# Altium schematic sheet NBT_PS2_INT.SCHDOC
size A4; Organization: Altium Limited; Address1: L3, 12a Rodborough Rd; Address2: Frenchs Forest; Address3: NSW; Address4: Australia 2086; DocumentNumber: 10; SheetNumber: 10; SheetTotal: 12
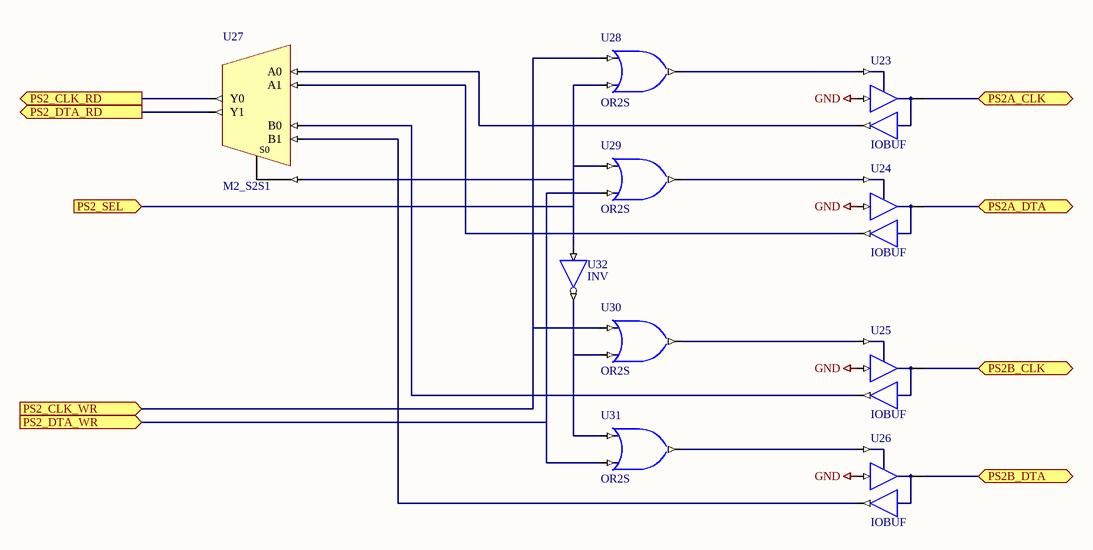
[diagram p0: NBT_PS2_INT.SCHDOC]

## Parts
U23  IOBUF
U24  IOBUF
U25  IOBUF
U26  IOBUF
U27  M2_S2S1
U28  OR2S
U29  OR2S
U30  OR2S
U31  OR2S
U32  INV

## Ports
PS2_CLK_RD (out), PS2_CLK_WR (in), PS2_DTA_RD (out), PS2_DTA_WR (in), PS2_SEL (in), PS2A_CLK (bidir), PS2A_DTA (bidir), PS2B_CLK (bidir), PS2B_DTA (bidir)

## Nets
GND: U23.I U24.I U25.I U26.I
PS2_CLK_RD: U27.Y0 ; port PS2_CLK_RD
PS2_CLK_WR: U28.I0 U30.I0 ; port PS2_CLK_WR
PS2_DTA_RD: U27.Y1 ; port PS2_DTA_RD
PS2_DTA_WR: U29.I1 U31.I1 ; port PS2_DTA_WR
PS2_SEL: U27.S0 U28.I1 U29.I0 U32.I ; port PS2_SEL
PS2A_CLK: U23.IO ; port PS2A_CLK
PS2A_DTA: U24.IO ; port PS2A_DTA
PS2B_CLK: U25.IO ; port PS2B_CLK
PS2B_DTA: U26.IO ; port PS2B_DTA
NetU23_O: U23.O U27.A0
NetU23_T: U23.T U28.O
NetU24_O: U24.O U27.A1
NetU24_T: U24.T U29.O
NetU25_O: U25.O U27.B0
NetU25_T: U25.T U30.O
NetU26_O: U26.O U27.B1
NetU26_T: U26.T U31.O
NetU30_I1: U30.I1 U31.I0 U32.O

## Notes on the sheet
- Title
- Size:
- Date:
- A4
- Number:
- Time:
- Revision:
- Sheet
- of
- File:

## Library data of the parts
U23-U26 = IOBUF: Input/Output Buffer; ArchiveName: GENERIC; Published: 7-Nov-2003; Publisher: Altium Limited; Xilinx Equivalent: IOBUF; Core Revision: 1.00.00
U27 = M2_S2S1: 2x2-Single Wire to 1x2-Single Wire Multiplexer; ArchiveName: GENERIC; Published: 7-Nov-2003; Publisher: Altium Limited; Core Revision: 1.00.00
U28-U31 = OR2S: 2-Input OR Gate, Single Pin Version; Xilinx Equivalent: OR2; ArchiveName: GENERIC; Published: 7-Nov-2003; Publisher: Altium Limited; Core Revision: 1.00.00
U32 = INV: Inverter; ArchiveName: GENERIC; Published: 7-Nov-2003; Publisher: Altium Limited; Xilinx Equivalent: INV; Core Revision: 1.00.00